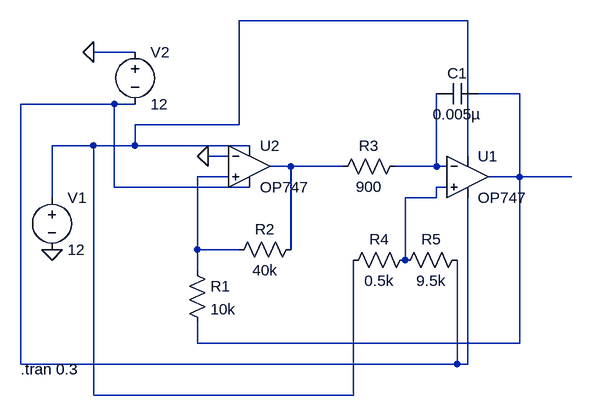
[diagram p0: schematic Most Stable Triangular and Saw Tooth.asc]
Most Stable Triangular and Saw Tooth.asc, the LTspice schematic file:
Version 4
SHEET 1 880 680
WIRE -304 32 -656 32
WIRE -816 80 -880 80
WIRE -224 144 -288 144
WIRE -848 160 -992 160
WIRE -816 160 -848 160
WIRE -656 192 -656 32
WIRE -656 192 -816 192
WIRE -880 224 -944 224
WIRE -816 224 -816 192
WIRE -816 224 -880 224
WIRE -640 224 -816 224
WIRE -672 240 -704 240
WIRE -304 240 -304 32
WIRE -576 256 -608 256
WIRE -496 256 -576 256
WIRE -352 256 -352 144
WIRE -352 256 -416 256
WIRE -336 256 -352 256
WIRE -672 272 -720 272
WIRE -224 272 -224 144
WIRE -224 272 -272 272
WIRE -144 272 -224 272
WIRE -848 288 -848 160
WIRE -640 288 -848 288
WIRE -336 288 -352 288
WIRE -944 304 -944 224
WIRE -352 304 -352 288
WIRE -352 304 -400 304
WIRE -720 384 -720 272
WIRE -656 384 -720 384
WIRE -576 384 -576 256
WIRE -400 400 -400 304
WIRE -720 416 -720 384
WIRE -720 528 -720 496
WIRE -224 528 -224 272
WIRE -224 528 -720 528
WIRE -992 560 -992 160
WIRE -320 560 -320 400
WIRE -320 560 -992 560
WIRE -304 560 -304 304
WIRE -304 560 -320 560
WIRE -880 608 -880 224
WIRE -480 608 -480 400
WIRE -480 608 -880 608
FLAG -704 240 0
FLAG -944 384 0
FLAG -880 80 0
SYMBOL OpAmps\\OP747 -640 192 R0
SYMATTR InstName U2
SYMBOL res -736 400 R0
SYMATTR InstName R1
SYMATTR Value 10k
SYMBOL res -560 368 R90
WINDOW 0 0 56 VBottom 2
WINDOW 3 32 56 VTop 2
SYMATTR InstName R2
SYMATTR Value 40k
SYMBOL res -400 240 R90
WINDOW 0 0 56 VBottom 2
WINDOW 3 32 56 VTop 2
SYMATTR InstName R3
SYMATTR Value 900
SYMBOL OpAmps\\OP747 -304 208 R0
SYMATTR InstName U1
SYMBOL cap -288 128 R90
WINDOW 0 0 32 VBottom 2
WINDOW 3 32 32 VTop 2
SYMATTR InstName C1
SYMATTR Value 0.005µ
SYMBOL voltage -944 288 R0
WINDOW 123 0 0 Left 0
WINDOW 39 0 0 Left 0
SYMATTR InstName V1
SYMATTR Value 12
SYMBOL voltage -816 64 R0
WINDOW 123 0 0 Left 0
WINDOW 39 0 0 Left 0
SYMATTR InstName V2
SYMATTR Value 12
SYMBOL res -384 384 R90
WINDOW 0 0 56 VBottom 2
WINDOW 3 32 56 VTop 2
SYMATTR InstName R4
SYMATTR Value 0.5k
SYMBOL res -304 384 R90
WINDOW 0 0 56 VBottom 2
WINDOW 3 32 56 VTop 2
SYMATTR InstName R5
SYMATTR Value 9.5k
TEXT -992 568 Left 2 !.tran 0.3

The netlist it stands for:
* Most Stable Triangular and Saw Tooth.asc
XU2 N006 0 N001 N003 N004 OP747  ; pins In+ In- V+ V- OUT
R1 N006 N002 10k
R2 N004 N006 40k
R3 N005 N004 900
XU1 N007 N005 N001 N003 N002 OP747  ; pins In+ In- V+ V- OUT
C1 N002 N005 0.005µ
V1 N001 0 12
V2 0 N003 12
R4 N007 N001 0.5k
R5 N003 N007 9.5k
.tran 0.3
.backanno
.end